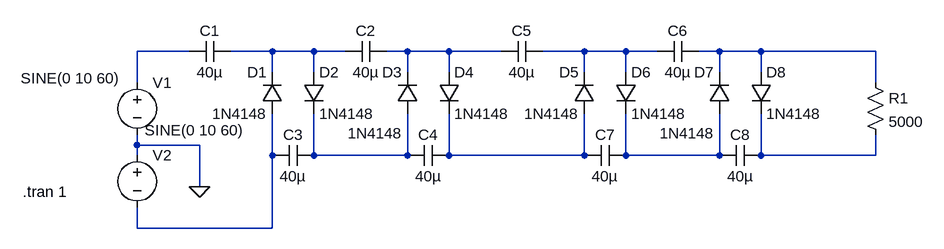
[diagram p0: schematic voltage_multiplier.asc]
voltage_multiplier.asc, the LTspice schematic file:
Version 4
SHEET 1 1108 680
WIRE -32 112 -112 112
WIRE 96 112 32 112
WIRE 160 112 96 112
WIRE 208 112 160 112
WIRE 304 112 272 112
WIRE 368 112 304 112
WIRE 448 112 368 112
WIRE 576 112 512 112
WIRE 640 112 576 112
WIRE 688 112 640 112
WIRE 784 112 752 112
WIRE 848 112 784 112
WIRE 1024 112 848 112
WIRE 96 144 96 112
WIRE 160 144 160 112
WIRE 304 144 304 112
WIRE 368 144 368 112
WIRE 576 144 576 112
WIRE 640 144 640 112
WIRE 784 144 784 112
WIRE 848 144 848 112
WIRE -112 160 -112 112
WIRE 1024 160 1024 112
WIRE -112 256 -112 240
WIRE -16 256 -112 256
WIRE -112 272 -112 256
WIRE 96 272 96 208
WIRE 160 272 160 208
WIRE 304 272 304 208
WIRE 304 272 160 272
WIRE 368 272 368 208
WIRE 576 272 576 208
WIRE 576 272 368 272
WIRE 640 272 640 208
WIRE 784 272 784 208
WIRE 784 272 640 272
WIRE 848 272 848 208
WIRE 1024 272 1024 240
WIRE 1024 272 848 272
WIRE -16 320 -16 256
WIRE -112 384 -112 352
WIRE 96 384 96 272
WIRE 96 384 -112 384
FLAG -16 320 0
SYMBOL diode 112 208 R180
WINDOW 0 24 64 Left 2
WINDOW 3 24 0 Left 2
SYMATTR InstName D1
SYMATTR Value 1N4148
SYMBOL diode 144 144 R0
SYMATTR InstName D2
SYMATTR Value 1N4148
SYMBOL diode 320 208 R180
WINDOW 0 24 64 Left 2
WINDOW 3 23 -30 Left 2
SYMATTR InstName D3
SYMATTR Value 1N4148
SYMBOL diode 352 144 R0
SYMATTR InstName D4
SYMATTR Value 1N4148
SYMBOL cap 32 96 R90
WINDOW 0 0 32 VBottom 2
WINDOW 3 32 32 VTop 2
SYMATTR InstName C1
SYMATTR Value 40µ
SYMBOL cap 272 96 R90
WINDOW 0 0 32 VBottom 2
WINDOW 3 32 32 VTop 2
SYMATTR InstName C2
SYMATTR Value 40µ
SYMBOL cap 160 256 R90
WINDOW 0 0 32 VBottom 2
WINDOW 3 32 32 VTop 2
SYMATTR InstName C3
SYMATTR Value 40µ
SYMBOL cap 368 256 R90
WINDOW 0 0 32 VBottom 2
WINDOW 3 32 32 VTop 2
SYMATTR InstName C4
SYMATTR Value 40µ
SYMBOL voltage -112 144 R0
WINDOW 3 -179 9 Left 2
WINDOW 123 0 0 Left 0
WINDOW 39 0 0 Left 0
SYMATTR Value SINE(0 10 60)
SYMATTR InstName V1
SYMBOL diode 592 208 R180
WINDOW 0 24 64 Left 2
WINDOW 3 24 0 Left 2
SYMATTR InstName D5
SYMATTR Value 1N4148
SYMBOL diode 624 144 R0
SYMATTR InstName D6
SYMATTR Value 1N4148
SYMBOL diode 800 208 R180
WINDOW 0 24 64 Left 2
WINDOW 3 23 -30 Left 2
SYMATTR InstName D7
SYMATTR Value 1N4148
SYMBOL diode 832 144 R0
SYMATTR InstName D8
SYMATTR Value 1N4148
SYMBOL cap 512 96 R90
WINDOW 0 0 32 VBottom 2
WINDOW 3 32 32 VTop 2
SYMATTR InstName C5
SYMATTR Value 40µ
SYMBOL cap 752 96 R90
WINDOW 0 0 32 VBottom 2
WINDOW 3 32 32 VTop 2
SYMATTR InstName C6
SYMATTR Value 40µ
SYMBOL cap 640 256 R90
WINDOW 0 0 32 VBottom 2
WINDOW 3 32 32 VTop 2
SYMATTR InstName C7
SYMATTR Value 40µ
SYMBOL cap 848 256 R90
WINDOW 0 0 32 VBottom 2
WINDOW 3 32 32 VTop 2
SYMATTR InstName C8
SYMATTR Value 40µ
SYMBOL res 1008 144 R0
SYMATTR InstName R1
SYMATTR Value 5000
SYMBOL voltage -112 256 R0
WINDOW 3 12 -23 Left 2
WINDOW 123 0 0 Left 0
WINDOW 39 0 0 Left 0
SYMATTR Value SINE(0 10 60)
SYMATTR InstName V2
TEXT -288 328 Left 2 !.tran 1

The netlist it stands for:
* voltage_multiplier.asc
D1 N006 N002 1N4148
D2 N002 N007 1N4148
D3 N007 N003 1N4148
D4 N003 N008 1N4148
C1 N002 N001 40µ
C2 N003 N002 40µ
C3 N007 N006 40µ
C4 N008 N007 40µ
V1 N001 0 SINE(0 10 60)
D5 N008 N004 1N4148
D6 N004 N009 1N4148
D7 N009 N005 1N4148
D8 N005 N010 1N4148
C5 N004 N003 40µ
C6 N005 N004 40µ
C7 N009 N008 40µ
C8 N010 N009 40µ
R1 N005 N010 5000
V2 0 N006 SINE(0 10 60)
.model D D
.lib standard.dio
.tran 1
.backanno
.end